# Altium schematic sheet uC.SchDoc
size A4; Organization: Altium Limited; Address1: L3, 12a Rodborough Rd; Address2: Frenchs Forest; Address3: NSW; Address4: Australia 2086; DocumentNumber: 1; SheetNumber: 1; SheetTotal: 5
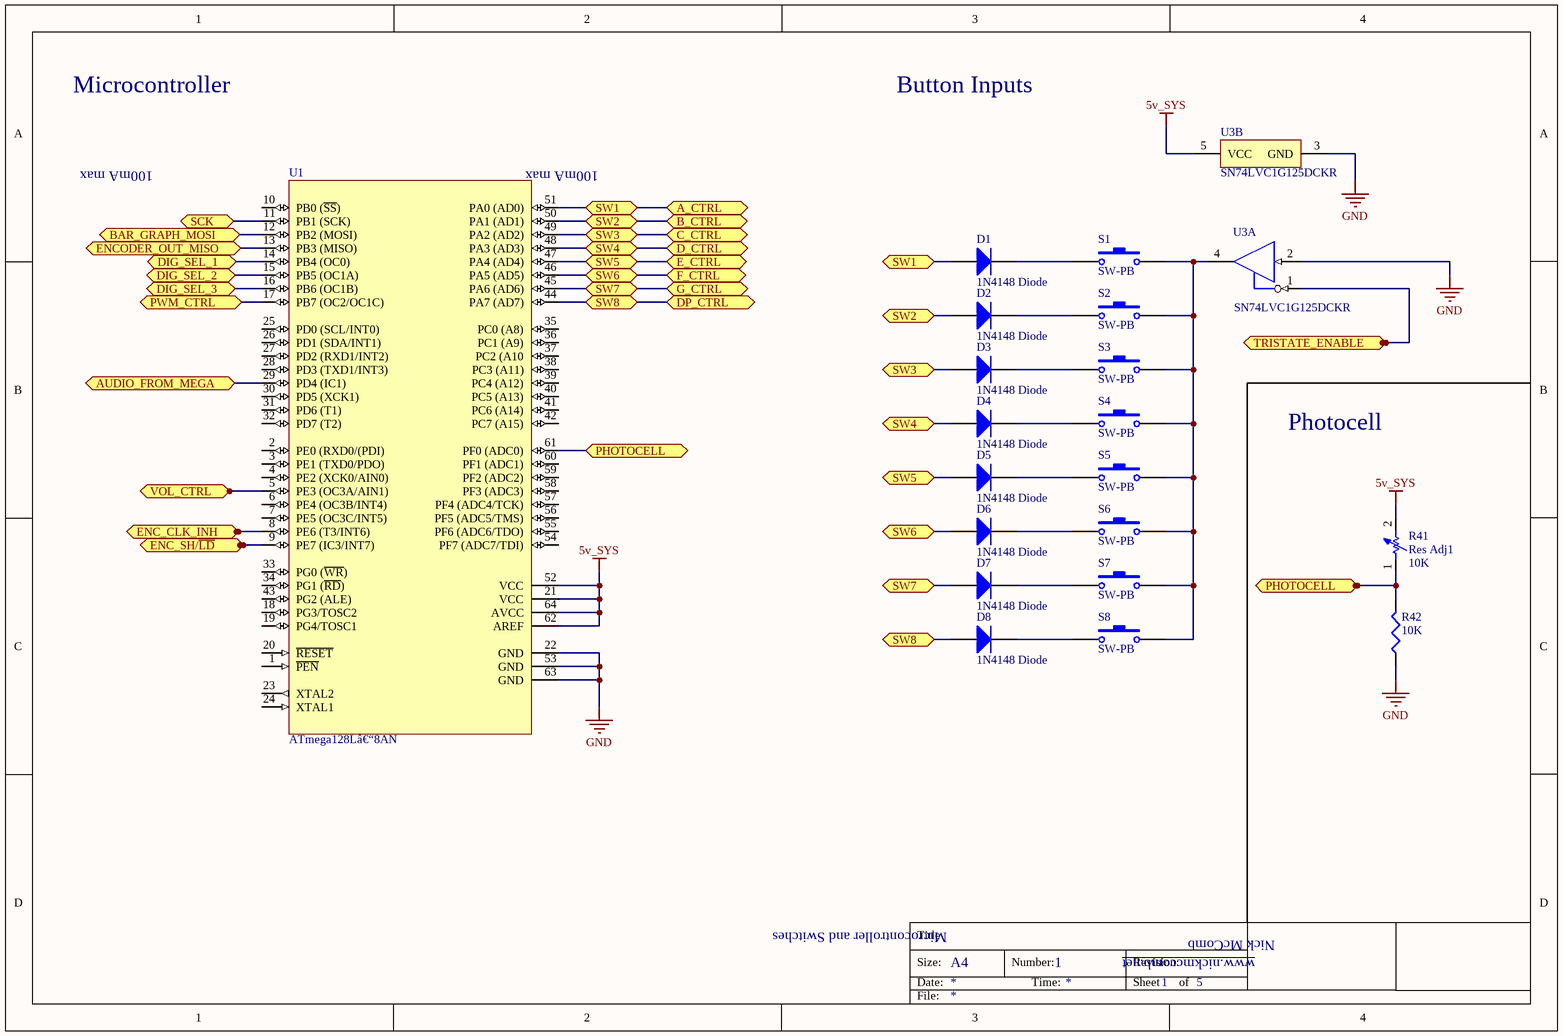
[diagram p0: uC.SchDoc]

## Parts
D1  1N4148 Diode  [S01575 Diode]
D2  1N4148 Diode  [S01575 Diode]
D3  1N4148 Diode  [S01575 Diode]
D4  1N4148 Diode  [S01575 Diode]
D5  1N4148 Diode  [S01575 Diode]
D6  1N4148 Diode  [S01575 Diode]
D7  1N4148 Diode  [S01575 Diode]
D8  1N4148 Diode  [S01575 Diode]
R41  Res Adj1  value 10K  [LOG POT]
R42  10K  [J1-0603]
S1  SW-PB  [SW-PB]
S2  SW-PB  [SW-PB]
S3  SW-PB  [SW-PB]
S4  SW-PB  [SW-PB]
S5  SW-PB  [SW-PB]
S6  SW-PB  [SW-PB]
S7  SW-PB  [SW-PB]
S8  SW-PB  [SW-PB]
U1  ATmega128Lâ€“8AN  [64A_M]
U3  SN74LVC1G125DCKR  [DCK0005A_M]  (parts A,B of 2)

## Ports
A_CTRL, AUDIO_FROM_MEGA, B_CTRL, BAR_GRAPH_MOSI, C_CTRL, D_CTRL, DIG_SEL_1, DIG_SEL_2, DIG_SEL_3, DP_CTRL, E_CTRL, ENC_CLK_INH, ENC_SH/~{LD}, ENCODER_OUT_MISO, F_CTRL, G_CTRL, PHOTOCELL, PWM_CTRL, SCK, SW1, SW2, SW3, SW4, SW5, SW6, SW7, SW8, TRISTATE_ENABLE, VOL_CTRL

## Nets
5v_SYS: R41.2 U1.21(VCC) U1.52(VCC) U1.62(AREF) U1.64(AVCC) U3.5(VCC)
GND: R42.1 U1.22(GND) U1.53(GND) U1.63(GND) U3.2(A) U3.3(GND)
A_CTRL: D1.3(A) U1.51(PA0_(AD0)) ; port SW1, port A_CTRL
AUDIO_FROM_MEGA: U1.29(PD4_(IC1)) ; port AUDIO_FROM_MEGA
B_CTRL: D2.3(A) U1.50(PA1_(AD1)) ; port SW2, port B_CTRL
BAR_GRAPH_MOSI: U1.12(PB2_(MOSI)) ; port BAR_GRAPH_MOSI
C_CTRL: D3.3(A) U1.49(PA2_(AD2)) ; port SW3, port C_CTRL
D_CTRL: D4.3(A) U1.48(PA3_(AD3)) ; port SW4, port D_CTRL
DIG_SEL_1: U1.14(PB4_(OC0)) ; port DIG_SEL_1
DIG_SEL_2: U1.15(PB5_(OC1A)) ; port DIG_SEL_2
DIG_SEL_3: U1.16(PB6_(OC1B)) ; port DIG_SEL_3
DP_CTRL: D8.3(A) U1.44(PA7_(AD7)) ; port SW8, port DP_CTRL
E_CTRL: D5.3(A) U1.47(PA4_(AD4)) ; port SW5, port E_CTRL
ENC_CLK_INH: U1.8(PE6_(T3/INT6)) ; port ENC_CLK_INH
ENC_SH/~{LD}: U1.9(PE7_(IC3/INT7)) ; port ENC_SH/~{LD}
ENCODER_OUT_MISO: U1.13(PB3_(MISO)) ; port ENCODER_OUT_MISO
F_CTRL: D6.3(A) U1.46(PA5_(AD5)) ; port SW6, port F_CTRL
G_CTRL: D7.3(A) U1.45(PA6_(AD6)) ; port SW7, port G_CTRL
PHOTOCELL: R41.1 R42.2 U1.61(PF0_(ADC0)) ; port PHOTOCELL
PWM_CTRL: U1.17(PB7_(OC2/OC1C)) ; port PWM_CTRL
SCK: U1.11(PB1_(SCK)) ; port SCK
TRISTATE_ENABLE: U3.1(~{OE}) ; port TRISTATE_ENABLE
VOL_CTRL: U1.5(PE3_(OC3A/AIN1)) ; port VOL_CTRL
NetD1_1: D1.1(K) S1.1
NetD2_1: D2.1(K) S2.1
NetD3_1: D3.1(K) S3.1
NetD4_1: D4.1(K) S4.1
NetD5_1: D5.1(K) S5.1
NetD6_1: D6.1(K) S6.1
NetD7_1: D7.1(K) S7.1
NetD8_1: D8.1(K) S8.1
NetS1_2: S1.2 S2.2 S3.2 S4.2 S5.2 S6.2 S7.2 S8.2 U3.4(Y)

Not connected (* = marked no-connect by the designer): U1 1(~{PEN}) 2(PE0_(RXD0/(PDI)) 3(PE1_(TXD0/PDO)) 4(PE2_(XCK0/AIN0)) 6(PE4_(OC3B/INT4)) 7(PE5_(OC3C/INT5)) 10(PB0_(~{SS})) 18(PG3/TOSC2) 19(PG4/TOSC1) 20(~{RESET}) 23(XTAL2) 24(XTAL1) 25(PD0_(SCL/INT0)) 26(PD1_(SDA/INT1)) 27(PD2_(RXD1/INT2)) 28(PD3_(TXD1/INT3)) 30(PD5_(XCK1)) 31(PD6_(T1)) 32(PD7_(T2)) 33(PG0_(~{WR})) 34(PG1_(~{RD})) 35(PC0_(A8)) 36(PC1_(A9)) 37(PC2_(A10) 38(PC3_(A11)) 39(PC4_(A12)) 40(PC5_(A13)) 41(PC6_(A14)) 42(PC7_(A15)) 43(PG2_(ALE)) 54(PF7_(ADC7/TDI)) 55(PF6_(ADC6/TDO)) 56(PF5_(ADC5/TMS)) 57(PF4_(ADC4/TCK)) 58(PF3_(ADC3)) 59(PF2_(ADC2)) 60(PF1_(ADC1))

## Notes on the sheet
- Microcontroller
- Button Inputs
- 100mA max
- Photocell
- Microcontroller and Switches
- Title
- Size:
- Date:
- A4
- Number:
- Time:
- Revision:
- Sheet
- of
- www.nickmccomb.net
- Nick McComb
- File:

## Library data of the parts
D1-D8 = Diode
R41 = Res Adj1: Variable Resistor; ComponentLink1URL: http://cdn.sparkfun.com/datasheets/Sensors/LightImaging/SEN-09088.pdf; ComponentLink1Description: A Photocell Datasheet
R42 = Res3: Resistor; Published: 8-Jun-2000; LatestRevisionDate: 29-May-2009; LatestRevisionNote: IPC-7351 Footprint Added.; PackageReference: J1-0603; Publisher: Altium Limited; PackageDescription: Chip Resistor; Value: 10K
S1-S8 = SW-PB: Switch
U1 = CMP-0095-00651-1: 8-bit AVR Microcontroller, 3.0-5.5V, 128KB Flash, 4KB EEPROM, 4KB SRAM, 64-pin TQFP, Extended Grade (-40°C to 105°C); PackageVersion: revC, Oct-2010; PackageDescription: 64-Pin Plastic Thin Profile Quad Flat Pack, 14 x 14 x 1.0 mm Body, 0.8 mm Pitch (TQFP); Code_JEDEC: MS-026-AEB; ComponentLink3Description: ATmega128(L) Summary; ComponentLink1URL: http://www.atmel.com/; PackageReference: 64A; ComponentLink2URL: http://www.atmel.com/dyn/resources/prod_documents/doc2467.pdf; DatasheetVersion: revX, Jun-2011; ComponentLink3URL: http://www.atmel.com/dyn/resources/prod_documents/2467S.pdf; ComponentLink2Description: ATmega128(L) Datasheet; ComponentLink1Description: Manufacturer URL
U3 = CMP-0859-00281-3: Single Bus Buffer Gate With 3-State Outputs, DCK0005A, LARGE T&R; Manufacturer: Texas Instruments; Bits(#): 1; tpd @ Nom Voltage(Max)(ns): 9,5.5,4.5,4; 3-State Output: Yes; Output Type: CMOS; Sub-Family: Non-Inverting Buffer/Driver; Logic: True; Output Drive (IOL/IOH)(Max)(mA): 32/-32; Voltage(Nom)(V): 1.8,2.5,3.3,5; ICC @ Nom Voltage(Max)(mA): 0.01; Technology Family: LVC; VCC(Min)(V): 1.65; VCC(Max)(V): 5.5; F @ Nom Voltage(Max)(Mhz): 150; Rating: Catalog; Input Type: CMOS/TTL; Schmitt Trigger: No; PackageReference: DCK0005A; Generic Part Number: SN74LVC1G125; DatasheetVersion: SCES223T; Operating Temperature Range(C): -40 to 125,-40 to 85; PartId: 1